# Altium schematic sheet Ikea Environmental Sensor-Module.SchDoc
size Tabloid; SheetNumber: 1; SheetTotal: 2; ENG_APP_DATE: --/--/--; DSN_APP_DATE: --/--/--; CHK_APP_DATE: --/--/--
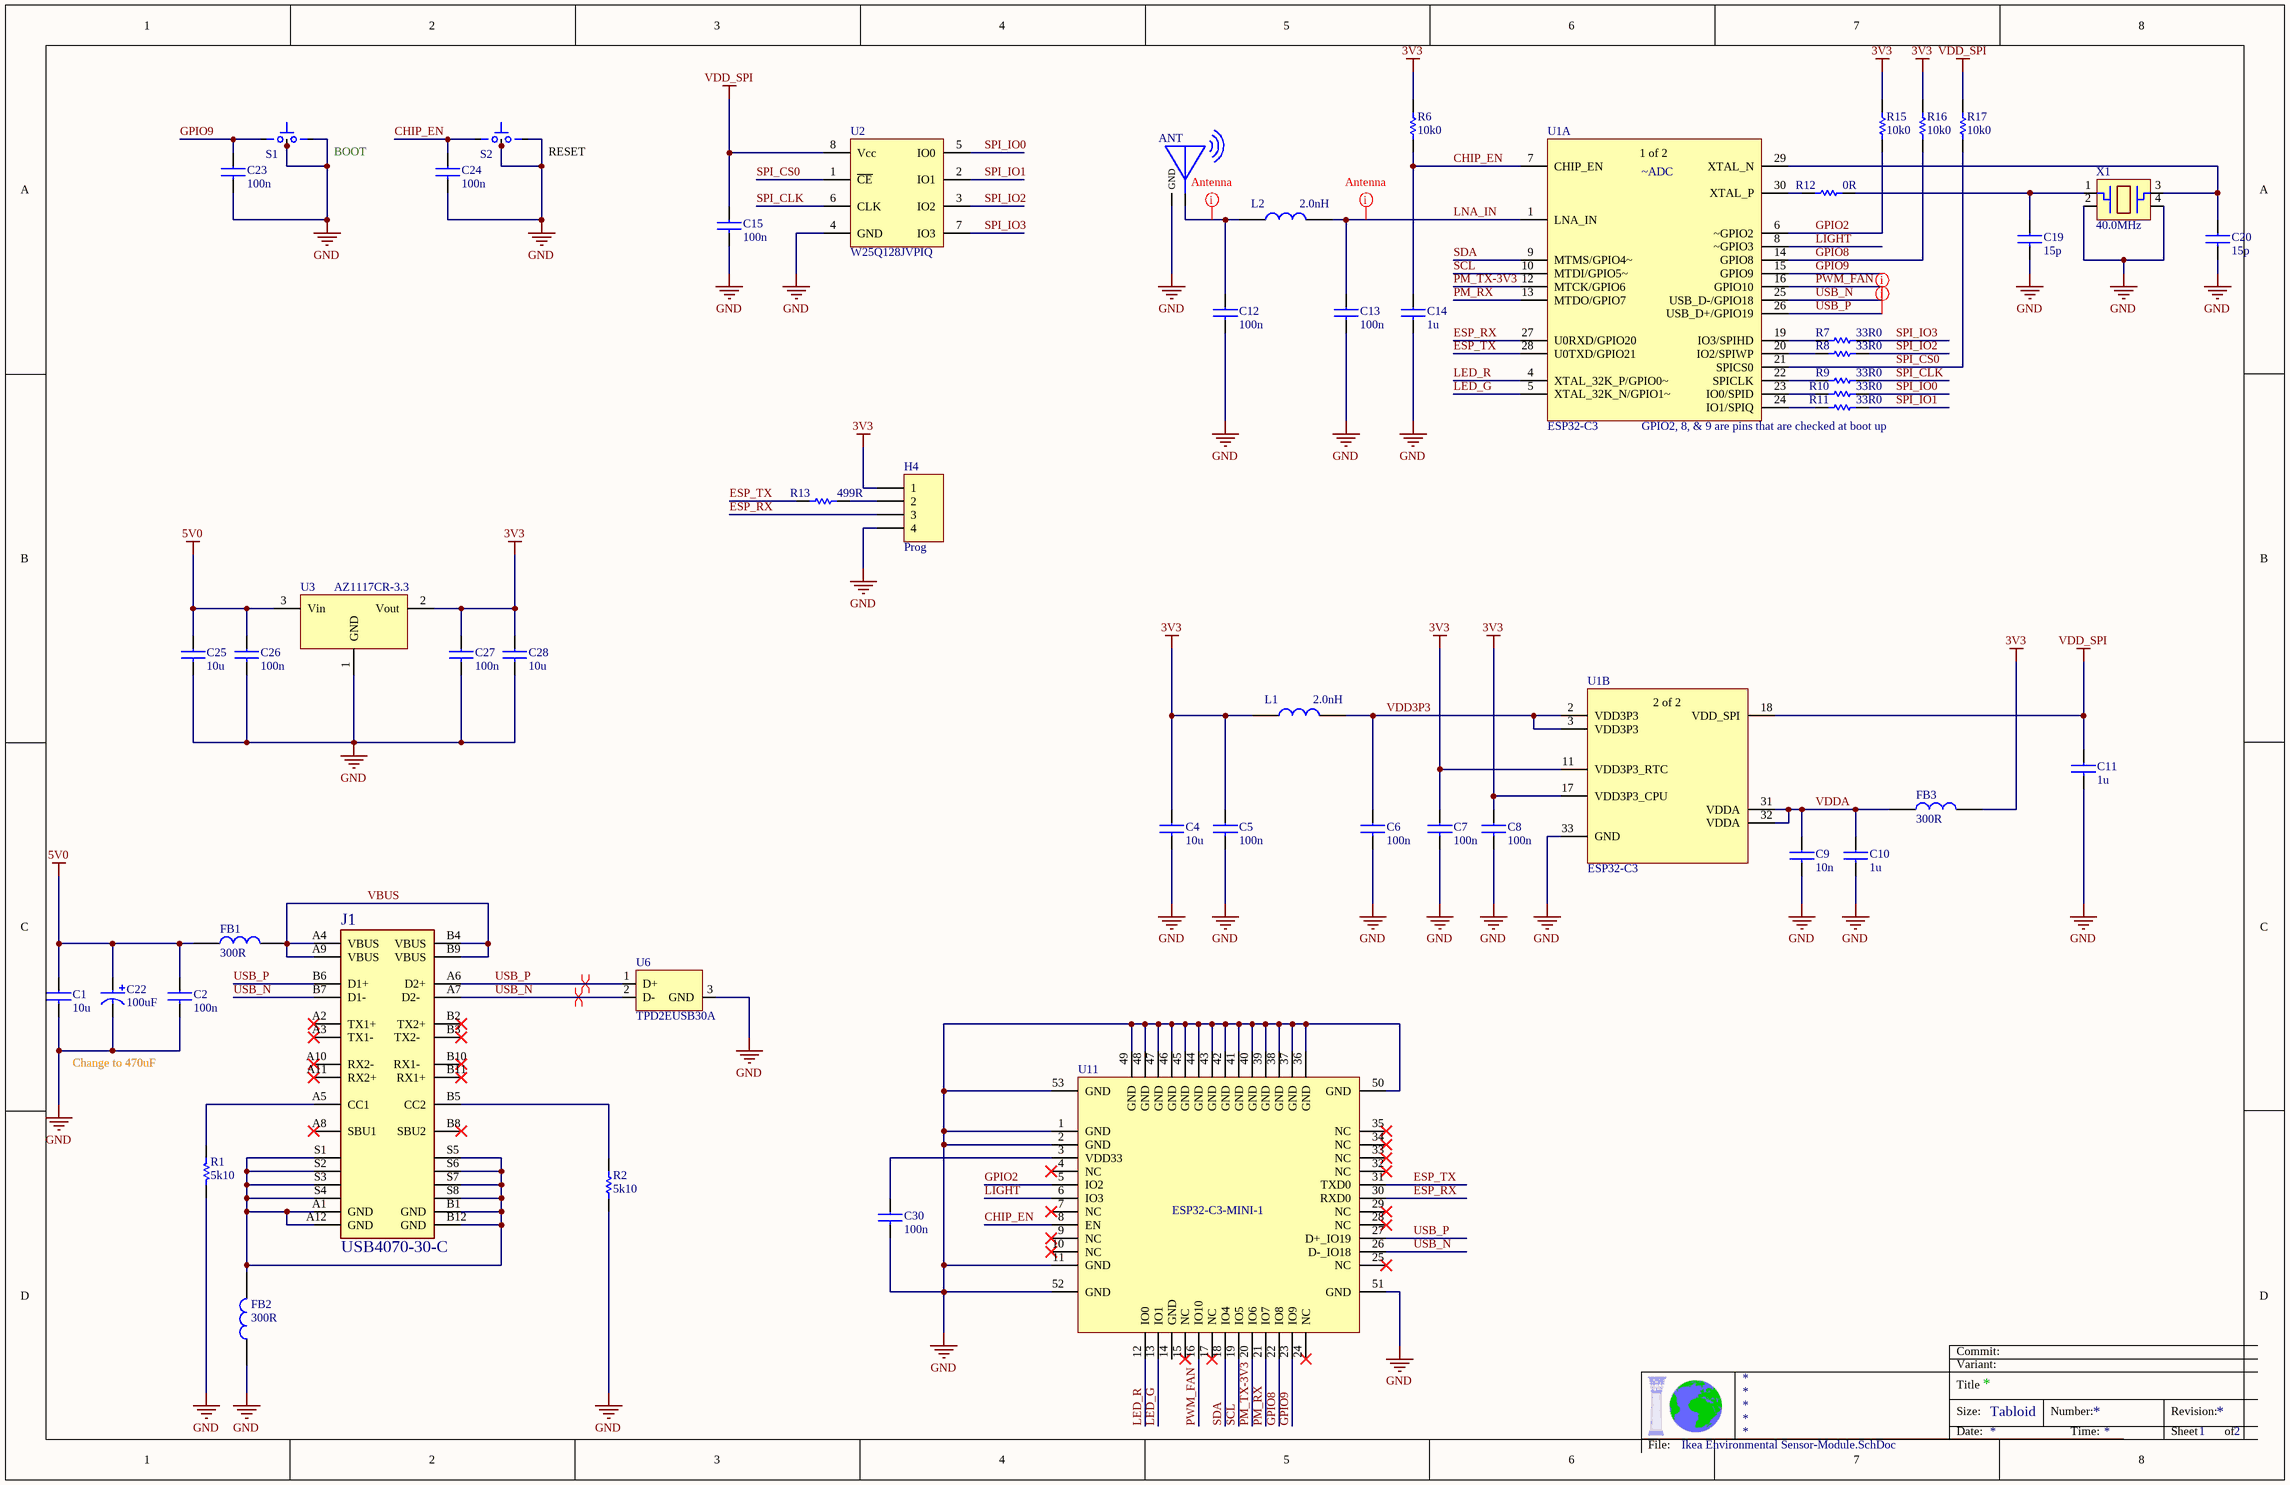
[diagram p0: Ikea Environmental Sensor-Module.SchDoc]

## Parts
ANT  PCB Antenna  [MINI-ANT-TYPED-H - Flipped]  (value not drawn)  (net tie, no BOM)
C1  10u  [0603X90]
C2  100n  [C_0402_N]
C4  10u  [0603X90]
C5  100n  [C_0402_N]
C6  100n  [C_0402_N]
C7  100n  [C_0402_N]
C8  100n  [C_0402_N]
C9  10n  [C_0402_N]
C10  1u  [C_0402_N]
C11  1u  [C_0402_N]
C12  100n  [C_0201]
C13  100n  [C_0201]
C14  1u  [C_0402_N]
C15  100n  [C_0402_N]
C19  15p  [C_0402_N]
C20  15p  [C_0402_N]
C22  value 100uF  [CAP_6.6x6.6]  (hidden comment: 100uF, 35V)
C23  100n  [C_0402_N]
C24  100n  [C_0402_N]
C25  10u  [0603X90]
C26  100n  [C_0402_N]
C27  100n  [C_0402_N]
C28  10u  [0603X90]
C30  100n  [C_0402_N]
FB1  300R  [FB_0402-NIC]
FB2  300R  [FB_0402-NIC]
FB3  300R  [FB_0402-NIC]
H4  Prog  [HDR1X4]
J1  USB4070-30-C  [USB_C_GCT_USB4070-30-C_REVC5]
L1  2.0nH  [FB_0402-NIC]
L2  2.0nH  [L_0201]
R1  5k10  [R_0402-N]
R2  5k10  [R_0402-N]
R6  10k0  [R_0402-N]
R7  33R0  [R_0402-N]
R8  33R0  [R_0402-N]
R9  33R0  [R_0402-N]
R10  33R0  [R_0402-N]
R11  33R0  [R_0402-N]
R12  0R  [R_0402-N]
R13  499R  [R_0402-N]
R15  10k0  [R_0402-N]
R16  10k0  [R_0402-N]
R17  10k0  [R_0402-N]
S1  BOOT  [SW_122514]
S2  RESET  [SW_122514]
U1  ESP32-C3  [QFN-32_5x5]  (parts A,B of 2)
U2  W25Q128JVPIQ  [WSON_8]
U3  AZ1117CR-3.3  [SOT89-150P410X160-3N]
U6  TPD2EUSB30A  [DRT3]
U11  ESP32-C3-MINI-1  [ESP32-C3-MINI-1]
X1  40.0MHz  [XTAL_3.2mmx2.5mm]

## Nets
3V3: C4.1 C5.1 C7.1 C8.1 C27.1 C28.1 FB3.2 H4.1 L1.1 R6.2 R15.2 R16.2 U1.11(VDD3P3_RTC) U1.17(VDD3P3_CPU) U3.2(Vout)
5V0: C1.1 C2.1 C22.1 C25.1 C26.1 FB1.1 U3.3(Vin)
GND: ANT.2(GND) C1.2 C2.2 C4.2 C5.2 C6.2 C7.2 C8.2 C9.2 C10.2 C11.2 C12.2 C13.2 C14.2 C15.2 C19.2 C20.2 C22.2 C23.2 C24.2 C25.2 C26.2 C27.2 C28.2 C30.2 FB2.1 H4.4 R1.1 R2.1 S1.2(B) S1.3 S1.4 S2.2(B) S2.3 S2.4 U1.33(GND) U2.4(GND) U3.1(GND) U6.3(GND) U11.1(GND) U11.2(GND) U11.11(GND) U11.36(GND) U11.37(GND) U11.38(GND) U11.39(GND) U11.40(GND) U11.41(GND) U11.42(GND) U11.43(GND) U11.44(GND) U11.45(GND) U11.46(GND) U11.47(GND) U11.48(GND) U11.49(GND) U11.50(GND) U11.51(GND) U11.52(GND) U11.53(GND) X1.2(GND) X1.4(GND)
VDD_SPI: C11.1 C15.1 R17.2 U1.18(VDD_SPI) U2.8(Vcc)
CHIP_EN: C14.1 C24.1 R6.1 S2.1(A) U1.7(CHIP_EN) U11.8(EN)
ESP_RX: H4.3 U1.27(U0RXD/GPIO20) U11.30(RXD0)
ESP_TX: R13.1 U1.28(U0TXD/GPIO21) U11.31(TXD0)
GPIO2: R15.1 U1.6(~GPIO2) U11.5(IO2)
GPIO8: R16.1 U1.14(GPIO8) U11.22(IO8)
GPIO9: C23.1 S1.1(A) U1.15(GPIO9) U11.23(IO9)
LED_G: U1.5(XTAL_32K_N/GPIO1~) U11.13(IO1)
LED_R: U1.4(XTAL_32K_P/GPIO0~) U11.12(IO0)
LIGHT: U1.8(~GPIO3) U11.6(IO3)
LNA_IN: C13.1 L2.2 U1.1(LNA_IN)
PM_RX: U1.13(MTDO/GPIO7) U11.21(IO7)
PM_TX-3V3: U1.12(MTCK/GPIO6) U11.20(IO6)
PWM_FAN: U1.16(GPIO10) U11.16(IO10)
SCL: U1.10(MTDI/GPIO5~) U11.19(IO5)
SDA: U1.9(MTMS/GPIO4~) U11.18(IO4)
SPI_CLK: R9.2 U2.6(CLK)
SPI_CS0: R17.1 U1.21(SPICS0) U2.1(~{CE})
SPI_IO0: R10.2 U2.5(IO0)
SPI_IO1: R11.2 U2.2(IO1)
SPI_IO2: R8.2 U2.3(IO2)
SPI_IO3: R7.2 U2.7(IO3)
USB_N: J1.A7(D2-) J1.B7(D1-) U1.25(USB_D-/GPIO18) U6.2(D-) U11.26(D-_IO18)
USB_P: J1.A6(D2+) J1.B6(D1+) U1.26(USB_D+/GPIO19) U6.1(D+) U11.27(D+_IO19)
VBUS: FB1.2 J1.A4(VBUS) J1.A9(VBUS) J1.B4(VBUS) J1.B9(VBUS)
VDD3P3: C6.1 L1.2 U1.2(VDD3P3) U1.3(VDD3P3)
VDDA: C9.1 C10.1 FB3.1 U1.31(VDDA) U1.32(VDDA)
NetANT_1: ANT.1 C12.1 L2.1
NetC19_1: C19.1 R12.2 X1.1
NetC20_1: C20.1 U1.29(XTAL_N) X1.3
NetC30_1: C30.1 U11.3(VDD33)
NetFB2_2: FB2.2 J1.A1(GND) J1.A12(GND) J1.B1(GND) J1.B12(GND) J1.S1(Shield) J1.S2(Shield) J1.S3(Shield) J1.S4(Shield) J1.S5(Shield) J1.S6(Shield) J1.S7(Shield) J1.S8(Shield)
NetH4_2: H4.2 R13.2
NetJ1_A5: J1.A5(CC1) R1.2
NetJ1_B5: J1.B5(CC2) R2.2
NetR7_1: R7.1 U1.19(IO3/SPIHD)
NetR8_1: R8.1 U1.20(IO2/SPIWP)
NetR9_1: R9.1 U1.22(SPICLK)
NetR10_1: R10.1 U1.23(IO0/SPID)
NetR11_1: R11.1 U1.24(IO1/SPIQ)
NetR12_1: R12.1 U1.30(XTAL_P)

Not connected (* = marked no-connect by the designer): J1 A2(TX1+)* A3(TX1-)* A8(SBU1)* A10(RX2-)* A11(RX2+)* B2(TX2+)* B3(TX2-)* B8(SBU2)* B10(RX1-)* B11(RX1+)*; U11 4(NC)* 7(NC)* 9(NC)* 10(NC)* 14(GND) 15(NC)* 17(NC)* 24(NC)* 25(NC)* 28(NC)* 29(NC)* 32(NC)* 33(NC)* 34(NC)* 35(NC)*

## Layout directives
differential pair: USB_N, USB_P
net class Antenna: LNA_IN, NetANT_1
net class USB: USB_N, USB_P

## Notes on the sheet
- GPIO2, 8, & 9 are pins that are checked at boot up
- Change to 470uF
- Variant:
- Commit:
- Title
- Size:
- Date:
- Tabloid
- Number:
- Time:
- Revision:
- Sheet
- of
- File:
- (in symbol U_ESP32-C3_QFN32, part A) 1 of 2; ~ADC
- (in symbol U_ESP32-C3_QFN32, part B) 2 of 2

## Library data of the parts
ANT = Antenna_PCB_MIFA: Antenna MIFA 2.4Gig; Manufacturer: Rainsun; Man_Part_Number: AN9520-245; Value: Chip Antenna; Vendor: LCSC; LCSC_Part_Number: C99665
C1 C4 C25 C28 = C_10u_10V_10_0603_NIC: Cap, Chip, 10uF, 10V, ± 15%, X5R, 0603; Manufacturer: NIC; Manufacturer_No: NMC0603X5R106K10TRPF; Dist_No: NMC0603X5R106K10TRPF; Distributor: NIC; HelpURL: http://www.niccomp.com/catalog/nmc1.pdf; Price: 0.02; IOT: IOT-0719
  C1: JLCPCB_Part_#: C96446
C2 C5-C8 C15 C23 C24 C26 C27 C30 = C_100n_16V_10_0402_NIC: Cap, Chip, 100nF, 16V, +/-10%, X7R, 0402; Manufacturer: NIC; Manufacturer_No: NMC0402X7R104K16TRPF; HelpURL: http://www.niccomp.com/catalog/nmc3.pdf; IOT: IOT-0301; Supplier 1: Future Electronics; Supplier Part Number 1: NMC0402X7R104K16TRPF-REEL
  C2: JLCPCB_Part_#: C307331
C9 = C_10n_25V_20_0402_NIC: Cap, Chip, 0.01uF, 25V, 20%, X7R, 0402; Manufacturer: NIC; Manufacturer_No: NMC0402X7R103K25TRP; HelpURL: http://www.niccomp.com/catalog/nmc2.pdf; IOT: IOT-0057; Supplier 1: Future Electronics; Supplier Part Number 1: NMC0402X7R103K25TRPF-REEL
C10 C11 C14 = C_1u_10V_10_0402_NIC: Cap, Chip, 1uF, 10V, 10%, X5R, 0402; Manufacturer: NIC; Manufacturer_No: NMC0402X5R105K10TRPF; IOT: IOT-; Dist_No: NMC0402X5R105K10TRPF; Distributor: Avnet; HelpURL: http://www.niccomp.com/catalog/nmc2.pdf; Price: 0.0056; Supplier 1: Future Electronics; Supplier Part Number 1: NMC0402X5R105K10TRPF-CUTT
C12 C13 = C_100n_25V_10_0201_Murata: Cap, Chip, 100nF, 25V, +/-10%, X5R, 0201; Manufacturer: Murata; Manufacturer_No: GRM033R61E104KE14J; Dist_No: Arrow; IOT: IOT-; Distributor: GRM033R61E104KE14J; HelpURL: https://search.murata.co.jp/Ceramy/image/img/A01X/G101/ENG/GRM033R61E104KE14-01.pdf; Supplier 1: Arrow Electronics; Supplier Part Number 1: GRM033R61E104KE14J; ComponentLink1Description: Datasheet; ComponentLink1URL: https://search.murata.co.jp/Ceramy/image/img/A01X/G101/ENG/GRM033R61E104KE14-01.pdf
C19 C20 = C_15p_25V_10_0402_NIC: Cap, Chip, 15pF, 25V, 10%, NPO 0402; Manufacturer: NIC; Manufacturer_No: NMC0402NPO150J25TRPF; HelpURL: http://www.niccomp.com/catalog/nmc1.pdf
C22 = C_100uF_35V_20_6.6mm_Panasonic: Cap AlEl, 100uF, 35V, 20%, 6.6mm dia.; Manufacturer_No: EEE-FK1V101XP; Manufacturer: Panasonic; IOT: IOT-0525; Distributor: Avnet; HelpURL: http://industrial.panasonic.com/www-cgi/jvcr13pz.cgi?E+PZ+3+ABA0120+EEEFK1V101XP+7+WW; Price: 0.1320; Supplier 1: Digi-Key; Supplier Part Number 1: PCE3836CT-ND
FB1-FB3 = FB_300R_0402_NIC: Ferrite bead,300 ohm@100MHz,0.15 ohm @DC, 1A, 0402; Manufacturer: NIC; Manufacturer_No: NCB-H0402P301TR100F; Distributor: NIC; Price: 0.01; HelpURL: http://www.niccomp.com/catalog/ncbh.pdf; Dist_No: NCB-H0402P301TR100F; Value: 300R; IOT: IOT-0720; Supplier 1: Digi-Key; Supplier Part Number 1: 490-5256-2-ND
H4 = Header 4: Header, 4-Pin
J1 = J_USB_C_REC_SMT_V: CONN RCPT USB 3.1 Type C Vertical SMT; Manufacturer: GCT; IOT: IOT-; Manufacturer_No: USB4070-30-C; Distributor: Future; Dist_No: USB4070-30-C; Price: 2.4; HelpURL: https://gct.co/files/drawings/usb4070.pdf?v=898ffa4a-86c9-4e61-8d6e-9ea790d66fc5#page=1; ComponentLink1Description: Datasheet; ComponentLink1URL: https://gct.co/files/drawings/usb4070.pdf?v=898ffa4a-86c9-4e61-8d6e-9ea790d66fc5#page=1; Supplier 1: Future Electronics; Supplier Part Number 1: 8074232; JLCPCB Part #: C168703
L1 = L_2nH_LQG15HS2N0S02D_0402: Inductor 2.0nH, +/-0.3nH, LQG15HS2N0S02D, 0402; Manufacturer: Murata; IOT: IOT-; Value: 2.0nH; Manufacturer_No: LQG15HS2N0S02D; Distributor: Avnet; Dist_No: LQG15HS2N0S02D; Datasheet: https://search.murata.co.jp/Ceramy/image/img/P02/JELF243B-0010.pdf; Price: .2597; Supplier 1: Arrow Electronics; Supplier Part Number 1: LQG15HN4N7S02D; JLCPCB Part #: C880712
L2 = L_2nH_LQP03TN2N0B02D_0201: Inductor 2.0nH, +/-0.1nH, 600mA, 0201; Manufacturer: Murata; IOT: IOT-; Value: 2.0nH; Manufacturer_No: LQP03TN2N0B02D; Distributor: Arrow; Dist_No: LQP03TN2N0B02D; Datasheet: https://search.murata.co.jp/Ceramy/image/img/P02/JELF243C-0015.pdf; Price: .2597; Supplier 1: Arrow Electronics; Supplier Part Number 1: LQP03TN2N0B02D
R1 R2 = R_5k10_60mW_1_0402_NIC: Resistor, 5.10 kΩ, 1%, 0.06W, 0402; Manufacturer_No: NRC04F5101TRF; Manufacturer: NIC; Value: 5.10k; HelpURL: http://www.niccomp.com/catalog/nrc.pdf; Supplier 1: Arrow Electronics; Supplier Part Number 1: NRC04F5101TRF; JLCPCB_Part_#: C25905
R6 R15-R17 = R_10k0_60mW_1_0402_NIC: Resistor, 10.0 kΩ, 1%, 0.06W, 0402; Manufacturer_No: NRC04F1002TRF; Manufacturer: NIC; Value: 10k; HelpURL: http://www.niccomp.com/catalog/nrc.pdf; IOT: IOT-0100
R7-R11 = R_33R0_60mW_1_0402_NIC: Resistor, 33.0 Ω, 1%, 0.06W, 0402; Manufacturer_No: NRC04F33R0TRF; Manufacturer: NIC; Value: 33; HelpURL: http://www.niccomp.com/catalog/nrc.pdf; IOT: IOT-0090
R12 = R_0R00_60mW_1_0402_NIC: Resistor, 0 Ω, 1%, 0.06W, 0402; Manufacturer_No: NRC04ZOTRF; Manufacturer: NIC; HelpURL: http://www.niccomp.com/catalog/nrc.pdf; IOT: IOT-0087; Value: 0R
R13 = R_499R_60mW_1_0402_NIC: Resistor, 499 Ω, 1%, 0.06W, 0402; Manufacturer_No: NRC04F4990TRF; Manufacturer: NIC; IOT: IOT-; Value: 499; Distributor: NIC; Dist_No: NRC04F4990TRF; HelpURL: http://www.niccomp.com/catalog/nrc.pdf; Supplier 1: Arrow Electronics; Supplier Part Number 1: NRC04F4990TRF
S1 S2 = SW_Side Actuated Button R/A: Side Actuated Button R/A; Manufacturer: HYP; Manufacturer_No: 1TS002G-2300-3500-CT; Dist_No: C319377; Value: Button R/A; Distributor: LCSC; JLCPCB Part #: C319377; ComponentLink1Description: Datasheet; ComponentLink1URL: https://datasheet.lcsc.com/lcsc/1811070920_HYP--Hongyuan-Precision-1TS002G-2300-3500-CT_C319377.pdf; Supplier 1: LCSC; Supplier Part Number 1: C319377
U1 = U_ESP32-C3_QFN32: IC, ESP32-C3, 160MHz RISC-V Single Core, QFN32; Manufacturer: Espressif Systems; Manufacturer_No: ESP32-C3; Supplier 1: Digi-Key; Supplier Part Number 1: 1904-ESP32-C3CT-ND; ComponentLink1Description: Datasheet; ComponentLink1URL: https://www.espressif.com/sites/default/files/documentation/esp32-c3_datasheet_en.pdf#page=21
U2 = U_W25Q128JVPIQ_WSON8: IC, Flash Memory 128Mb (16Mkx8), 3.3V, WSON8-5x6; Manufacturer: Winbond; Distributor: Arrow; Dist_No: W25Q128JVPIQ; HelpURL: http://www.winbond.com/resource-files/w25q16jv%20spi%20revg%2003222018%20plus.pdf; Manufacturer_No: W25Q128JVPIQ; Price: 0.35; ComponentLink1Description: Datasheet; ComponentLink1URL: https://www.winbond.com/resource-files/W25Q128JV%20RevH%2003102021%20Plus.pdf; Supplier 1: Arrow Electronics; Supplier Part Number 1: W25Q128JVPIQ; JLCPCB Part #: C2803379
U3 = U_AZ1117CR-3.3TRG1_SOT89-3: IC, CONV DC/DC LDO 3.3V, 15V In 1A, SOT89-3; Manufacturer: Diodes Inc; IOT: IOT-; Distributor: Arrow; Dist_No: AZ1117CR-3.3TRG1; HelpURL: https://www.diodes.com/assets/Datasheets/AZ1117C.pdf#page=14; Manufacturer_No: AZ1117CR-3.3TRG1; Price: 0.15; Supplier 1: Verical; Supplier Part Number 1: AZ1117CR-3.3TRG1; JLCPCB Part #: C347256
U6 = U_TPD2EUSB30A-SOT_DRT-3: 2 Channel ESD for USB 3.0; Manufacturer: Texas Instruments; Manufacturer_No: TPD2EUSB30ADRTR; Datasheet: http://www.ti.com/lit/gpn/tpd2eusb30a; Distributor: Avnet; HelpURL: http://www.ti.com/lit/gpn/tpd2eusb30a; IOT: IOT-0557; Price: 0.1641; Supplier 1: Digi-Key; Supplier Part Number 1: 296-28153-2-ND; JLCPCB_Part_#: C94934
U11 = U_ESP32-C3-MINI-1: IC, ESP32-C3-MINI-1 Module; Manufacturer: Espressif; ComponentLink1URL: https://www.espressif.com/sites/default/files/documentation/esp32-c3-mini-1_datasheet_en.pdf#page=22; Manufacturer_No: ESP32-C3-MINI-1; Price: 2.0; IOT: *; ComponentLink1Description: Datasheet; JLCPCB Part #: C2838502; Supplier 1: Digi-Key; Supplier Part Number 1: 1965-ESP32-C3-MINI-1-H4CT-ND
X1 = X_40.000MHZ_12pF_3225: X-tal, 40.000MHz, Cl=4pF, +-10ppm, 3.2x2.5; Manufacturer: ABRACON Co; Manufacturer_No: ABM8W-40.0000MHZ-4-B1U-T3; Dist_No: 535-9130-1-ND; HelpURL: http://www.abracon.com/Resonators/abm3b.pdf; Distributor: DIGIKEY; Price: 1.38; Supplier 1: Arrow Electronics; Supplier Part Number 1: ABM8W-40.0000MHZ-4-B1U-T3; JLCPCB Part #: C90924; ComponentLink1Description: Datasheet; ComponentLink1URL: https://abracon.com/Resonators/ABM8W.pdf